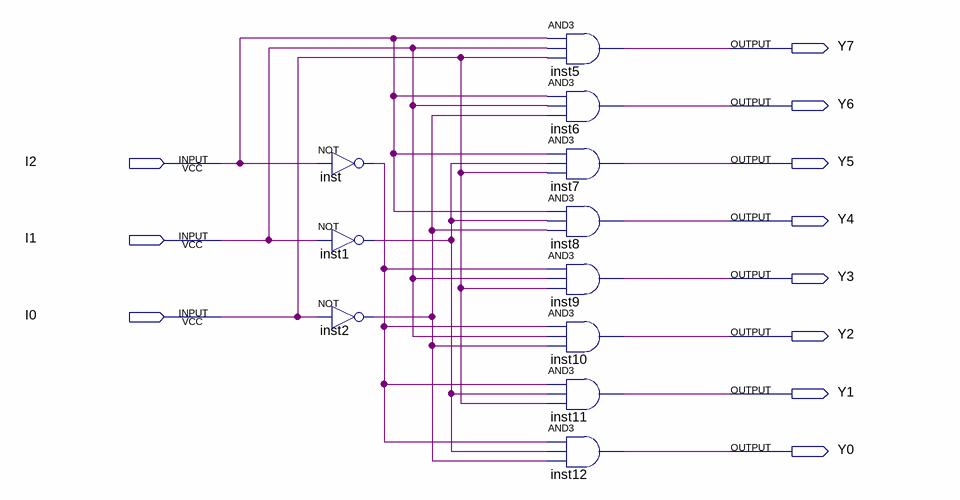
[diagram p0: schematic sheet]
// Quartus schematic 3-8decoder.bdf as structural Verilog: 11 symbols, 11 pins
module \3-8decoder  (
  input  I2,
  input  I1,
  input  I0,
  output Y7,
  output Y6,
  output Y5,
  output Y4,
  output Y3,
  output Y2,
  output Y1,
  output Y0
);

  wire inst1_out, inst2_out, inst_out;

  not inst (inst_out, I2);
  not inst1 (inst1_out, I1);
  not inst2 (inst2_out, I0);
  and inst5 (Y7, I2, I1, I0);
  and inst6 (Y6, I2, I1, inst2_out);
  and inst7 (Y5, I2, inst1_out, I0);
  and inst8 (Y4, I2, inst1_out, inst2_out);
  and inst9 (Y3, inst_out, I1, I0);
  and inst10 (Y2, inst_out, I1, inst2_out);
  and inst11 (Y1, inst_out, inst1_out, I0);
  and inst12 (Y0, inst_out, inst1_out, inst2_out);
endmodule
